# Altium schematic sheet Sch_ALICE.SchDoc
size A4; SheetNumber: 1; SheetTotal: 1
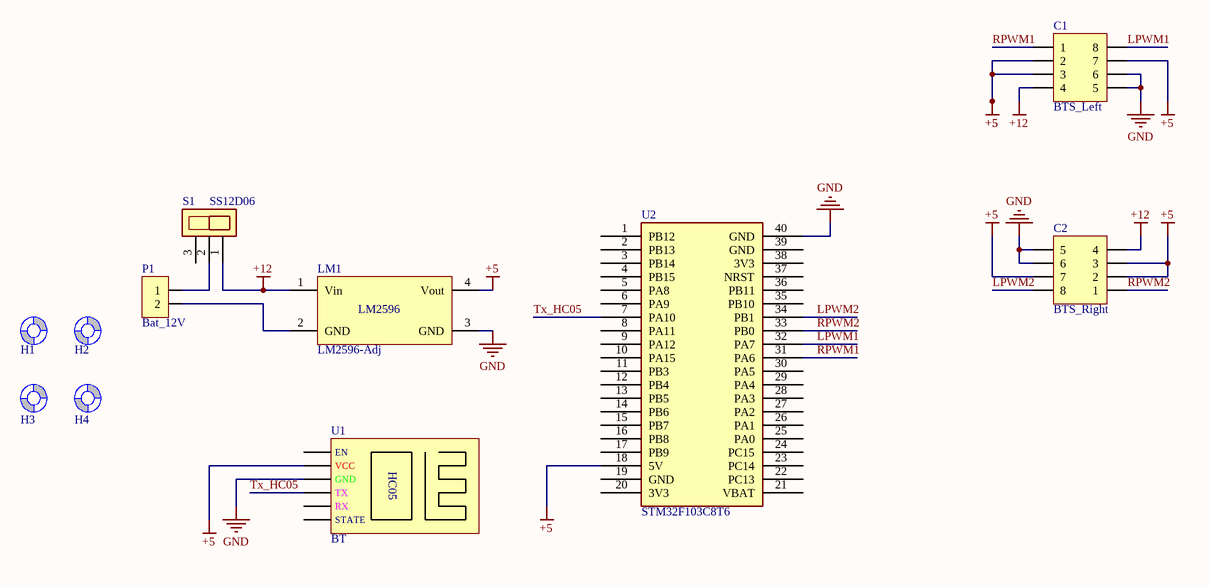
[diagram p0: Sch_ALICE.SchDoc]

## Parts
C1  BTS_Left  [JP4-D2T]
C2  BTS_Right  [JP4-D2T]
H1  Screw Hole  [SCREW/3.0/6.0]  (value not drawn)  (no BOM)
H2  Screw Hole  [SCREW/3.0/6.0]  (value not drawn)  (no BOM)
H3  Screw Hole  [SCREW/3.0/6.0]  (value not drawn)  (no BOM)
H4  Screw Hole  [SCREW/3.0/6.0]  (value not drawn)  (no BOM)
LM1  LM2596-Adj  [lm2596]
P1  Bat_12V  [HDR/Terminal/2/5mm]
S1  SS12D06  [SS12D06]
U1  BT  [HC05]
U2  STM32F103C8T6  [Stm32 BluePill]

## Nets
+5: C1.2 C1.3 C1.7 C2.2 C2.3 C2.7 LM1.4(Vout) U1.2 U2.18(5V)
+12: C1.4 C2.4 LM1.1(Vin) S1.1
GND: C1.5 C1.6 C2.5 C2.6 LM1.3(GND) U1.3 U2.40(GND)
LPWM1: C1.8 U2.32(PA7)
LPWM2: C2.8 U2.34(PB1)
RPWM1: C1.1 U2.31(PA6)
RPWM2: C2.1 U2.33(PB0)
Tx_HC05: U1.4 U2.7(PA10)
NetLM1_2: LM1.2(GND) P1.2
NetP1_1: P1.1 S1.2

Not connected (* = marked no-connect by the designer): H1 1(Screw); H2 1(Screw); H3 1(Screw); H4 1(Screw); S1 3; U1 1 5 6; U2 1(PB12) 2(PB13) 3(PB14) 4(PB15) 5(PA8) 6(PA9) 8(PA11) 9(PA12) 10(PA15) 11(PB3) 12(PB4) 13(PB5) 14(PB6) 15(PB7) 16(PB8) 17(PB9) 19(GND) 20(3V3) 21(VBAT) 22(PC13) 23(PC14) 24(PC15) 25(PA0) 26(PA1) 27(PA2) 28(PA3) 29(PA4) 30(PA5) 35(PB10) 36(PB11) 37(NRST) 38(3V3) 39(GND)

## Notes on the sheet
- (in symbol HC05) EN; VCC; GND; TX; RX; STATE
- (in symbol LM2596-Adj) LM2596

## Library data of the parts
C1 C2 = JP4x2: WR-PHD 2.54 mm Dual Socket Header; Manufacturer: W¨¹rth Elektronik eiSos GmbH; partNo: 61300821821; ComponentLink1 Description: Manufacturer; ComponentLink2 Description: Datasheet; NoPins: 08; Created Date: 29 March 2013; ComponentLink1URL: http://www.we-online.com; ComponentLink2URL: http://katalog.we-online.de/em/datasheet/6130xx21821.pdf; Created by: Karrer Zheng
LM1 = LM2596-Adj: Designed By @Alixahedi
P1 = Header 2: Header, 2-Pin
S1 = SS12D06: Lying Slide Switch 3 Pins.
U1 = HC05: Bluetooth HC05 Module
U2 = BluePill: Designed By @Alixahedi
H1-H4 = Screw Hole: TYPE: NO-BOM; UNIT PRICE: 0